# EAGLE design osi-brain_rev_1 (EAGLE 6.3)
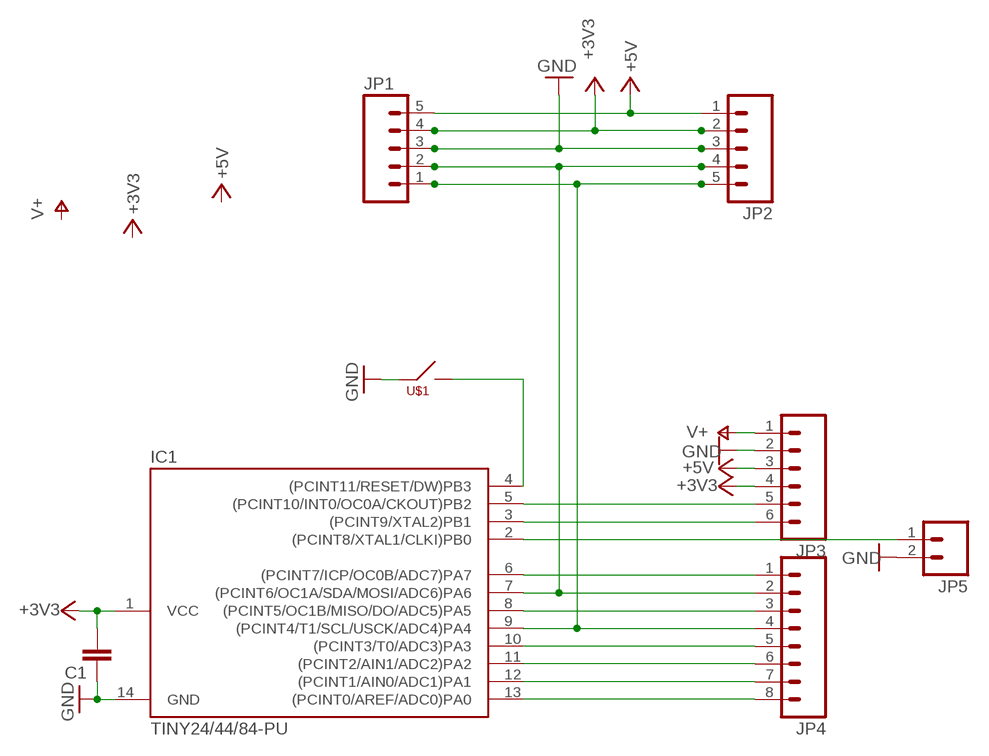
[diagram p0: schematic, sheet 1]

## Parts
C1  CAPKIT  [CAP-PTH-SMALL-KIT]
IC1  TINY24/44/84-PU  [DIL14]
JP1  M05PTH  [1X05]
JP2  M05PTH  [1X05]
JP3  M06SIP  [1X06]
JP4  M081X08  [1X08]
JP5  M021X02_NO_SILK  [1X02_NO_SILK]
U$1  PTS635_SWITCH  [PTS635_SWITCH]

## Nets
+3V3: C1.2 IC1.1(VCC) JP1.4 JP2.2 JP3.4
+5V: JP1.5 JP2.1 JP3.3
AREF_D0: IC1.13((PCINT0/AREF/ADC0)PA0) JP4.8
D1: IC1.12((PCINT1/AIN0/ADC1)PA1) JP4.7
D2: IC1.11((PCINT2/AIN1/ADC2)PA2) JP4.6
D3: IC1.10((PCINT3/T0/ADC3)PA3) JP4.5
D5: IC1.8((PCINT5/OC1B/MISO/DO/ADC5)PA5) JP4.3
D7: IC1.6((PCINT7/ICP/OC0B/ADC7)PA7) JP4.1
D8: IC1.5((PCINT10/INT0/OC0A/CKOUT)PB2) JP3.5
D9: IC1.3((PCINT9/XTAL2)PB1) JP3.6
D10: IC1.2((PCINT8/XTAL1/CLKI)PB0) JP5.1
GND: C1.1 IC1.14(GND) JP1.3 JP2.3 JP3.2 JP5.2 U$1.P$1
RESET: IC1.4((PCINT11/RESET/DW)PB3) U$1.P$2
SCL_D4: IC1.9((PCINT4/T1/SCL/USCK/ADC4)PA4) JP1.1 JP2.5 JP4.4
SDA_D6: IC1.7((PCINT6/OC1A/SDA/MOSI/ADC6)PA6) JP1.2 JP2.4 JP4.2
V+: JP3.1

## Library data of the parts
C1 = SparkFun:CAP: Capacitor Standard 0603 ceramic capacitor, and 0.1" leaded capacitor.
IC1 = avr-7:TINY24/44/84
JP1 JP2 = SparkFun_mod:M05: Header 5 Standard 5-pin 0.1" header. Use with straight break away headers (SKU : PRT-00116), right angle break away headers (PRT-00553), swiss pins (PRT-00743), machine pins (PRT-00117), and female headers (PRT-00115). Molex polarized connector foot print use with SKU : PRT-08230 with associated crimp pins and housings.
JP3 = SparkFun:M06: Header 6 Standard 6-pin 0.1" header. Use with straight break away headers (SKU : PRT-00116), right angle break away headers (PRT-00553), swiss pins (PRT-00743), machine pins (PRT-00117), and female headers (PRT-00115). Molex polarized connector foot print use with SKU : PRT-08094 with associated crimp pins and housings. NOTES ON THE VARIANTS LOCK and LOCK_LONGPADS... This footprint was designed to help hold the alignment of a through-hole component (i.e. 6-pin header) while soldering it into place. You may notice that each hole has been shifted either up or down by 0.005 of an inch from it's more standard position (which is a perfectly straight line). This slight alteration caused the pins (the squares in the middle) to touch the edges of the holes. Because they are alternating, it causes a "brace" to hold the component in place. 0.005 has proven to be the perfect amount of "off-center" position when using our standard breakaway headers. Although looks a little odd when you look at the bare footprint, once you have a header in there, the alteration is very hard to notice. Also, if you push a header all the way into place, it is covered up entirely on the bottom side. This idea of altering the position of holes to aid alignment will be further integrated into the Sparkfun Library for other footprints. It can help hold any component with 3 or more connection pins.
JP4 = SparkFun:M08: Header 8 Standard 8-pin 0.1" header. Use with straight break away headers (SKU : PRT-00116), right angle break away headers (PRT-00553), swiss pins (PRT-00743), machine pins (PRT-00117), and female headers (PRT-00115).
JP5 = SparkFun_mod:M02: Header 2 Standard 2-pin 0.1" header. Use with straight break away headers (SKU : PRT-00116), right angle break away headers (PRT-00553), swiss pins (PRT-00743), machine pins (PRT-00117), and female headers (PRT-00115). Molex polarized connector foot print use with SKU : PRT-08233 with associated crimp pins and housings.
U$1 = _my-parts:PTS635_SWITCH: www.ck-components.com

## Board
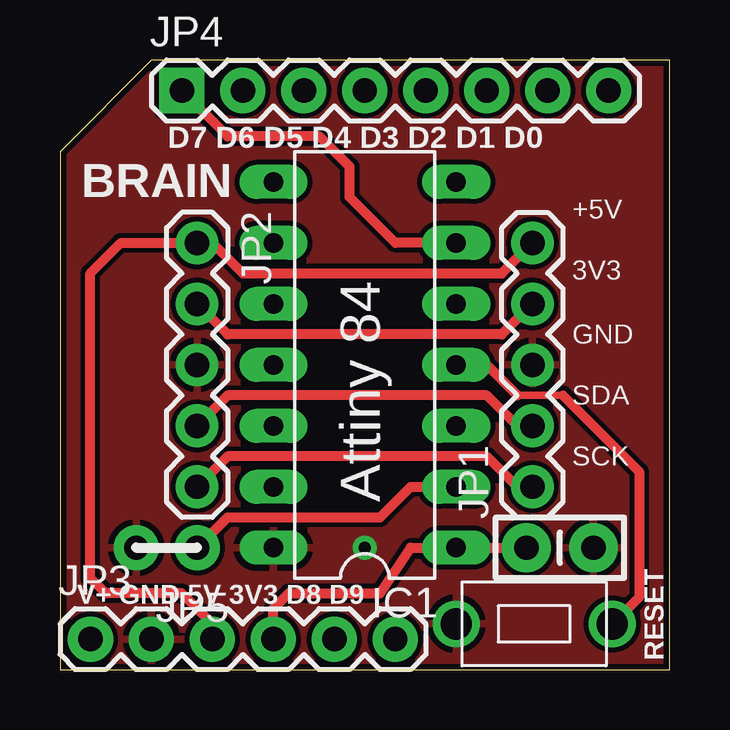
[diagram p1: board, top side]
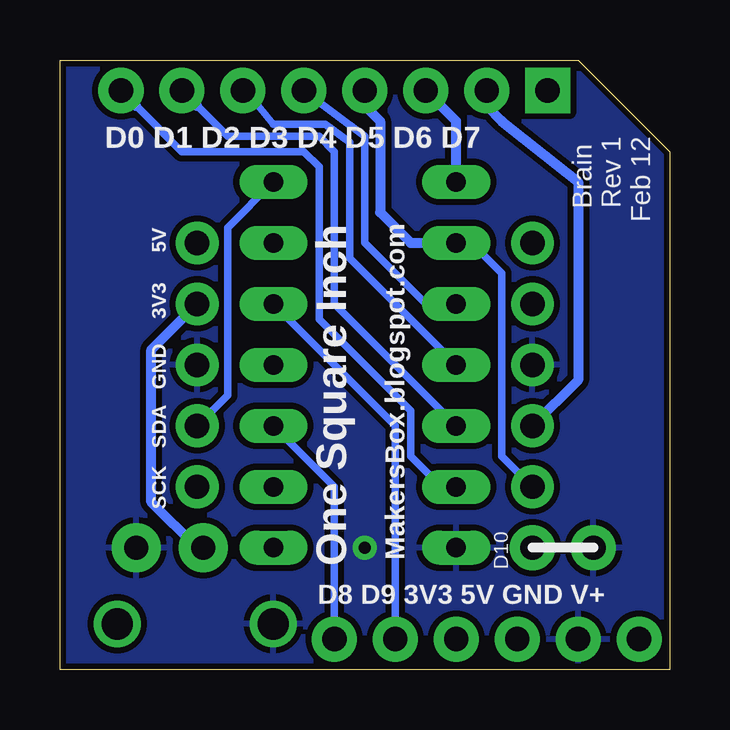
[diagram p2: board, bottom side, seen from below]

Size 25.4 x 25.4 mm. Coordinates in mm from the lower left corner, seen from the top.
Outline: 25.4,25.4 25.4,21.59 25.4,0 24.77,0 24.77,0 0,0 0,21.59
Outline: 25.4,25.4 3.81,25.4 0,21.59
Outline: 0,21.59 0,21.59
Copper layers (1*16): Top 0.035mm / dielectric 1.5mm / Bottom 0.035mm
Design rules "SparkFun": minimum track width 8mil, minimum drill 20mil, track to track 8mil, track to pad 8mil, pad to pad 8mil, via to via 8mil, smd to smd 8mil, copper to edge 10mil, drill to drill 8mil, minimum pad ring 12mil, minimum via ring 10mil, stop-mask expansion 4mil, vias tented up to drill 25mil, thermal gap 10mil

### Footprints (pad centres in the part's own frame; a part is rotated, then mirrored left to right if it is on the bottom)
CAP-PTH-SMALL-KIT = drill 1.016 pad 2.032: 1 -1.397,0; 2 1.397,0
DIL14 = drill 0.813 long: 1 -7.62,-3.81; 2 -5.08,-3.81; 3 -2.54,-3.81; 4 0,-3.81; 5 2.54,-3.81; 6 5.08,-3.81; 7 7.62,-3.81; 8 7.62,3.81; 9 5.08,3.81; 10 2.54,3.81; 11 0,3.81; 12 -2.54,3.81; 13 -5.08,3.81; 14 -7.62,3.81
1X05 = drill 1.016 pad 1.778: 1 0,0; 2 2.54,0; 3 5.08,0; 4 7.62,0; 5 10.16,0
1X06 = drill 1.016 pad 1.88: 1 0,0; 2 2.54,0; 3 5.08,0; 4 7.62,0; 5 10.16,0; 6 12.7,0
1X08 = drill 1.016 pad 1.88 square: 1 0,0 | drill 1.016 pad 1.88: 2 2.54,0; 3 5.08,0; 4 7.62,0; 5 10.16,0; 6 12.7,0; 7 15.24,0; 8 17.78,0
1X02_NO_SILK = drill 1.016 pad 1.88: 1 0,0; 2 2.54,0
PTS635_SWITCH = drill 1.3: P$1 0,0; P$2 6.5,0

### Placement (x,y rotation side)
C1  20.83,5.08 180 top
IC1  12.7,12.7 90 top
JP1  19.68,7.62 90 top
JP2  5.71,17.78 270 top
JP3  1.27,1.27 0 top
JP4  5.08,24.13 0 top
JP5  5.71,5.08 180 top
U$1  16.51,1.91 0 top

### Tracks (layer width: path | path; a pad name or v marks a point on that pad's centre or on a via)
+3V3
  Top 0.406: JP1.4 18.41,13.97 6.99,13.97 JP2.2 | C1.2 IC1.1 14.61,5.08 13.34,3.17 9.53,3.17 8.89,2.54 JP3.4
  Bottom 0.406: C1.2 19.68,5.08 21.59,6.99 21.59,13.34 JP1.4
+5V
  Top 0.406: JP1.5 18.41,16.51 7.62,16.51 6.35,17.78 JP2.1 2.54,17.78 1.27,16.51 1.27,3.81 1.91,3.17 5.08,3.17 6.35,1.91 JP3.3
AREF_D0
  Bottom 0.305: IC1.13 9.53,7.62 10.79,8.89 10.79,10.79 14.61,14.61 14.61,20.95 15.24,21.59 20.32,21.59 22.23,23.5
  Bottom 0.406: JP4.8 22.23,23.5
D1
  Bottom 0.305: IC1.12 13.97,15.24 13.97,21.59 14.61,22.23 18.41,22.23 19.68,23.5
  Bottom 0.406: JP4.7 19.68,23.5
D2
  Bottom 0.305: IC1.11 13.34,17.14 13.34,21.97 14.35,22.73 16.51,22.73 17.14,23.5 JP4.6
D3
  Bottom 0.305: IC1.10 10.16,15.24 12.7,17.78 12.7,22.23 JP4.5
D5
  Bottom 0.406: IC1.8 8.89,22.86 JP4.3
D7
  Top 0.406: IC1.6 13.97,17.78 12.06,19.68 12.06,20.95 10.79,22.23 6.99,22.23 JP4.1
D8
  Bottom 0.305: IC1.5 11.43,10.16 JP3.5
D9
  Bottom 0.305: IC1.3 13.97,7.62 JP3.6
D10
  Top 0.406: IC1.2 14.61,7.62 13.34,6.35 6.99,6.35 JP5.1
GND  (via drill 0.51)
  other vias: 12.7,5.08
  pour Bottom (isolate 0.254): -1.27,26.67 26.67,26.67 26.67,-1.27 -1.27,-1.27
  pour Top: -0.64,26.04 26.67,26.04 26.67,0 26.04,-0.64 -0.64,-0.64
RESET
  Top 0.305: 19.05,11.43 20.95,11.43
  Top 0.406: IC1.4 17.78,12.7 19.05,11.43 | 20.95,11.43 24.13,8.26 24.13,3.02 U$1.P$2
SCL_D4
  Top 0.406: JP1.1 19.05,7.62 17.78,8.89 6.99,8.89 JP2.5
  Bottom 0.305: 8.26,17.78 6.99,16.51 6.99,8.89 JP2.5
  Bottom 0.406: JP4.4 12.7,23.5 12.06,22.86 12.06,19.05 10.79,17.78 IC1.9 8.26,17.78
SDA_D6
  Top 0.406: JP1.2 19.05,10.16 17.78,11.43 6.99,11.43 JP2.4
  Bottom 0.305: IC1.7 18.41,18.41 18.41,11.43 JP1.2
  Bottom 0.406: JP2.4 3.81,12.06 3.81,20.32 6.99,22.86 7.62,23.5 JP4.2

### Text on the board
tPlace: D7 D6 D5 D4 D3 D2 D1 D0 | BRAIN | +5V | 3V3 | GND | SDA | SCK | Attiny 84 | V+ GND 5V 3V3 D8 D9 | RESET
bPlace: Brain / Rev 1 / Feb 12 | D0 D1 D2 D3 D4 D5 D6 D7 | 5V | 3V3 | GND | SDA | SCK | MakersBox.blogspot.com | D10 | One Square Inch | D8 D9 3V3 5V GND V+